# Altium schematic sheet main.SchDoc
size 420 x 297 mm; Author: ALTIUM GOSTBOM2.0 KEV; SheetNumber: 1; SheetTotal: 3; Наименование_организации: НИТУ МИСИС; п_Разраб_Р: Хрущев А.С.
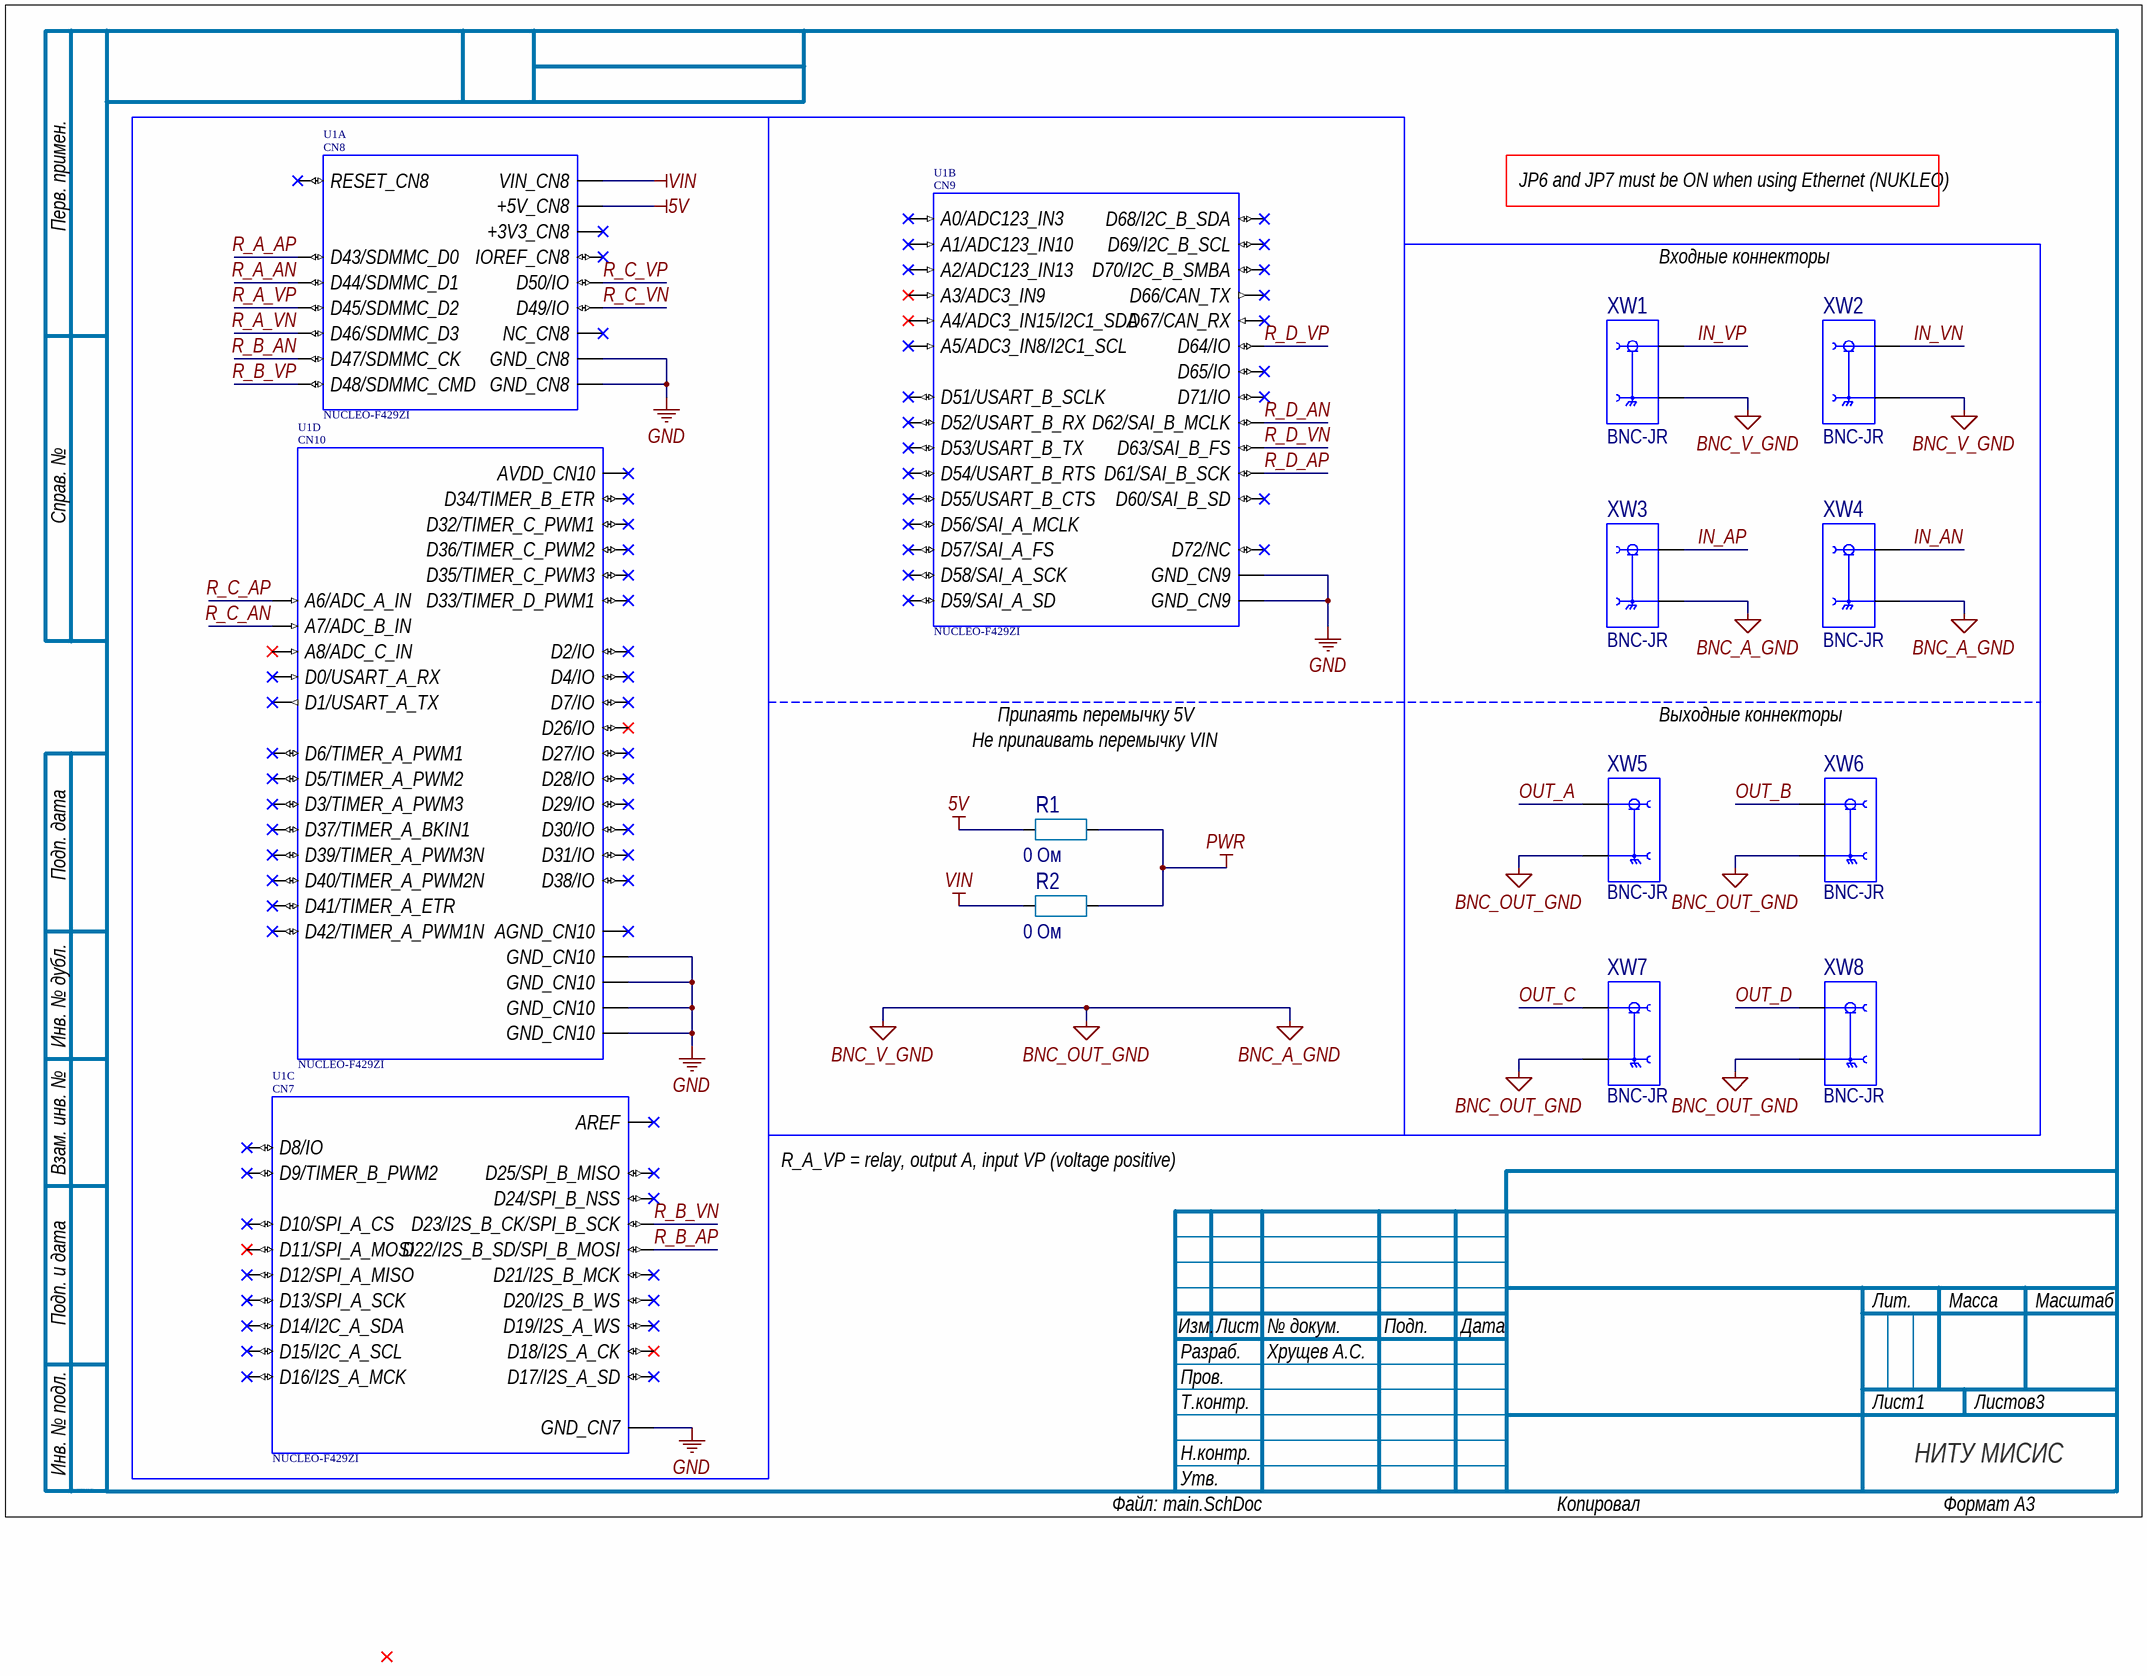
[diagram p0: main.SchDoc]

## Parts
R1  0 Ом  [R0805]
R2  0 Ом  [R0805]
U1  NUCLEO-F429ZI  [MODULE_NUCLEO-F429ZI]  (parts A,B,C,D of 4)
XW1  BNC-JR  [TE_227161-1]
XW2  BNC-JR  [TE_227161-1]
XW3  BNC-JR  [TE_227161-1]
XW4  BNC-JR  [TE_227161-1]
XW5  BNC-JR  [TE_227161-1]
XW6  BNC-JR  [TE_227161-1]
XW7  BNC-JR  [TE_227161-1]
XW8  BNC-JR  [TE_227161-1]

## Nets
5V: R1.1 U1.CN8_9(+5V_CN8)
BNC_A_GND: XW1.2(GND) XW2.2(GND) XW3.2(GND) XW4.2(GND) XW5.2(GND) XW6.2(GND) XW7.2(GND) XW8.2(GND)  [also labelled BNC_OUT_GND, BNC_V_GND]
GND: U1.CN7_8(GND_CN7) U1.CN8_11(GND_CN8) U1.CN8_13(GND_CN8) U1.CN9_12(GND_CN9) U1.CN9_23(GND_CN9) U1.CN10_5(GND_CN10) U1.CN10_17(GND_CN10) U1.CN10_22(GND_CN10) U1.CN10_27(GND_CN10)
PWR: R1.2 R2.2
VIN: R2.1 U1.CN8_15(VIN_CN8)
IN_AN: XW4.1(SIG)
IN_AP: XW3.1(SIG)
IN_VN: XW2.1(SIG)
IN_VP: XW1.1(SIG)
OUT_A: XW5.1(SIG)
OUT_B: XW6.1(SIG)
OUT_C: XW7.1(SIG)
OUT_D: XW8.1(SIG)
R_A_AN: U1.CN8_4(D44/SDMMC_D1)
R_A_AP: U1.CN8_2(D43/SDMMC_D0)
R_A_VN: U1.CN8_8(D46/SDMMC_D3)
R_A_VP: U1.CN8_6(D45/SDMMC_D2)
R_B_AN: U1.CN8_10(D47/SDMMC_CK)
R_B_AP: U1.CN7_13(D22/I2S_B_SD/SPI_B_MOSI)
R_B_VN: U1.CN7_15(D23/I2S_B_CK/SPI_B_SCK)
R_B_VP: U1.CN8_12(D48/SDMMC_CMD)
R_C_AN: U1.CN10_9(A7/ADC_B_IN)
R_C_AP: U1.CN10_7(A6/ADC_A_IN)
R_C_VN: U1.CN8_14(D49/IO)
R_C_VP: U1.CN8_16(D50/IO)
R_D_AN: U1.CN9_26(D62/SAI_B_MCLK)
R_D_AP: U1.CN9_24(D61/SAI_B_SCK)
R_D_VN: U1.CN9_28(D63/SAI_B_FS)
R_D_VP: U1.CN9_30(D64/IO)

Not connected (* = marked no-connect by the designer): U1 CN7_1(D16/I2S_A_MCK)* CN7_2(D15/I2C_A_SCL)* CN7_3(D17/I2S_A_SD)* CN7_4(D14/I2C_A_SDA)* CN7_5(D18/I2S_A_CK)* CN7_6(AREF)* CN7_7(D19/I2S_A_WS)* CN7_9(D20/I2S_B_WS)* CN7_10(D13/SPI_A_SCK)* CN7_11(D21/I2S_B_MCK)* CN7_12(D12/SPI_A_MISO)* CN7_14(D11/SPI_A_MOSI)* CN7_16(D10/SPI_A_CS)* CN7_17(D24/SPI_B_NSS)* CN7_18(D9/TIMER_B_PWM2)* CN7_19(D25/SPI_B_MISO)* CN7_20(D8/IO)* CN8_1(NC_CN8)* CN8_3(IOREF_CN8)* CN8_5(RESET_CN8)* CN8_7(+3V3_CN8)* CN9_1(A0/ADC123_IN3)* CN9_2(D51/USART_B_SCLK)* CN9_3(A1/ADC123_IN10)* CN9_4(D52/USART_B_RX)* CN9_5(A2/ADC123_IN13)* CN9_6(D53/USART_B_TX)* CN9_7(A3/ADC3_IN9)* CN9_8(D54/USART_B_RTS)* CN9_9(A4/ADC3_IN15/I2C1_SDA)* CN9_10(D55/USART_B_CTS)* CN9_11(A5/ADC3_IN8/I2C1_SCL)* CN9_13(D72/NC)* CN9_14(D56/SAI_A_MCLK)* CN9_15(D71/IO)* CN9_16(D57/SAI_A_FS)* CN9_17(D70/I2C_B_SMBA)* CN9_18(D58/SAI_A_SCK)* CN9_19(D69/I2C_B_SCL)* CN9_20(D59/SAI_A_SD)* CN9_21(D68/I2C_B_SDA)* CN9_22(D60/SAI_B_SD)* CN9_25(D67/CAN_RX)* CN9_27(D66/CAN_TX)* CN9_29(D65/IO)* CN10_1(AVDD_CN10)* CN10_2(D7/IO)* CN10_3(AGND_CN10)* CN10_4(D6/TIMER_A_PWM1)* CN10_6(D5/TIMER_A_PWM2)* CN10_8(D4/IO)* CN10_10(D3/TIMER_A_PWM3)* CN10_11(A8/ADC_C_IN)* CN10_12(D2/IO)* CN10_13(D26/IO)* CN10_14(D1/USART_A_TX)* CN10_15(D27/IO)* CN10_16(D0/USART_A_RX)* CN10_18(D42/TIMER_A_PWM1N)* CN10_19(D28/IO)* CN10_20(D41/TIMER_A_ETR)* CN10_21(D29/IO)* CN10_23(D30/IO)* CN10_24(D40/TIMER_A_PWM2N)* CN10_25(D31/IO)* CN10_26(D39/TIMER_A_PWM3N)* CN10_28(D38/IO)* CN10_29(D32/TIMER_C_PWM1)* CN10_30(D37/TIMER_A_BKIN1)* CN10_31(D33/TIMER_D_PWM1)* CN10_32(D36/TIMER_C_PWM2)* CN10_33(D34/TIMER_B_ETR)* CN10_34(D35/TIMER_C_PWM3)*

## Notes on the sheet
- JP6 and JP7 must be ON when using Ethernet (NUKLEO)
- Входные коннекторы
- Не припаивать перемычку VIN
- Припаять перемычку 5V
- Выходные коннекторы
- R_A_VP = relay, output A, input VP (voltage positive)
- Перв. примен.
- Справ. №
- Подп. дата
- Инв. № дубл.
- Взам. инв. №
- Подп. и дата
- Изм.
- Разраб.
- Лист
- № докум.
- Подп.
- Дата
- Лит.
- Масса
- Масштаб
- Пров.
- Т.контр.
- Листов
- Инв. № подл.
- Н.контр.
- Утв.
- ALTIUM GOSTBOM2.0 KEV
- Файл:
- Копировал
- Формат А3
- (in symbol NUCLEO-F429ZI, part A) CN8
- (in symbol NUCLEO-F429ZI, part B) CN9
- (in symbol NUCLEO-F429ZI, part C) CN7
- (in symbol NUCLEO-F429ZI, part D) CN10

## Library data of the parts
R1 R2 = R1_POSTOYANNYJ: Резистор 0 Ом; Value: 0 Ом
U1 = NUCLEO-F429ZI: STM32F429ZI, mbed-Enabled Development Nucleo-144 STM32F4 ARMÂ® CortexÂ®-M4 MCU 32-Bit Embedded Evaluation Board; MF: STMicroelectronics; SnapEDA_Link: https://www.snapeda.com/parts/NUCLEO-F429ZI/STMicroelectronics/view-part/?ref=snap; Package: None; Value: *; MP: NUCLEO-F429ZI; Check_prices: https://www.snapeda.com/parts/NUCLEO-F429ZI/STMicroelectronics/view-part/?ref=eda
XW1-XW8 = BNC-JR: Разъём высокочастотный RUICHI BNC-JR, гнездо на плату; MP: 227161-1; Package: None; Price: None; Value: *; Availability: Unavailable; Supplier 1: DigiKey; Supplier Part Number 1: 900-0731713061-ND